# EAGLE schematic bubbles-mk-1.0 (EAGLE 6.5.0)
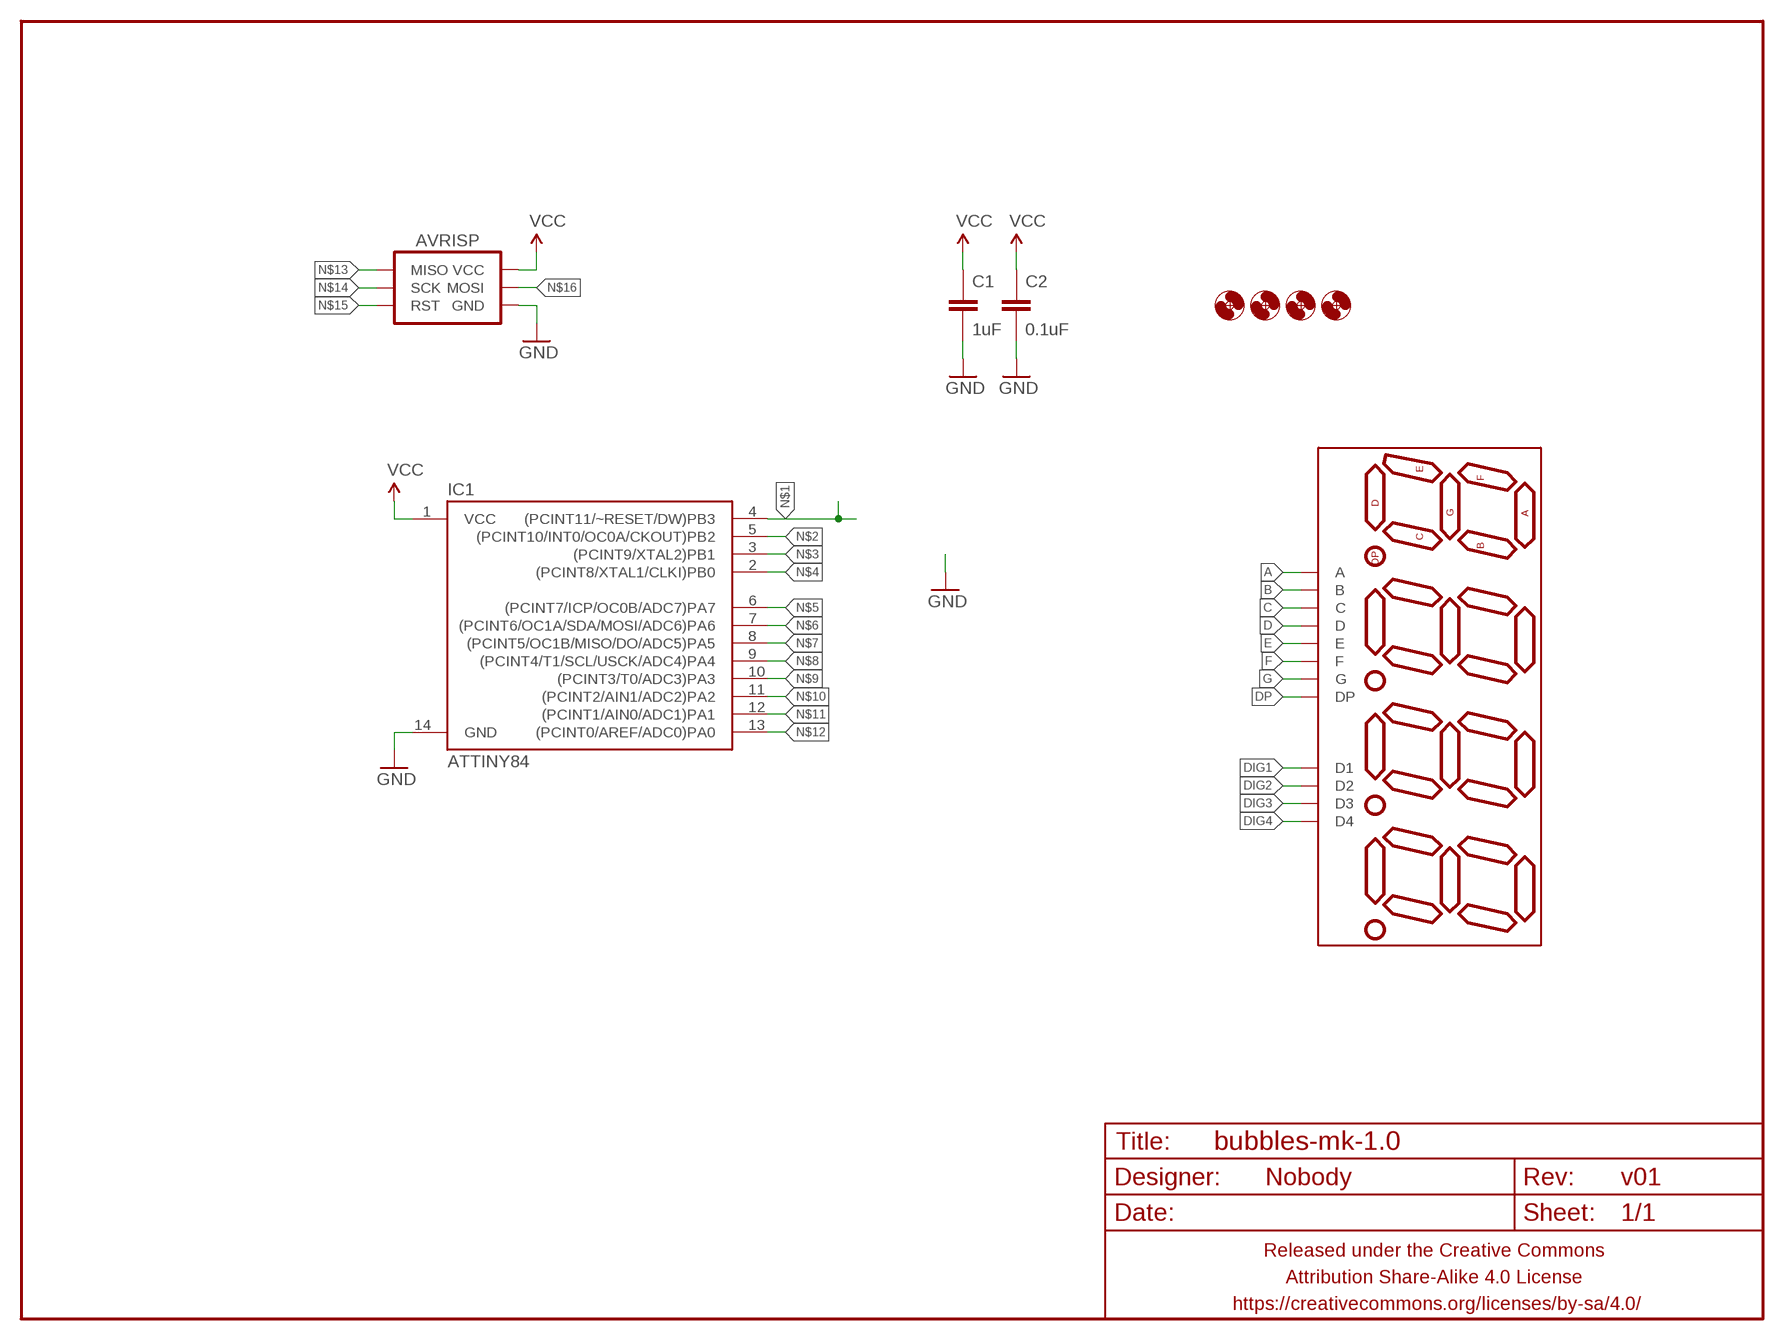
[diagram p0: schematic, sheet 1]

## Parts
AVRISP  AVR_SPI_PRG_6AVR-JST-PTH-RA-I2C  [AVR-JST-6-PTH-RA-I2C]
C1  1uF  CAPACITOR-CERAMIC025-024X044  [C025-024X044]
C2  0.1uF  CAPACITOR-CERAMIC025-024X044  [C025-024X044]
DISP1  BUBBLES!  7-SEGMENT-4DIGIT-COUNTER-HP-BUBBLE  [DIL12]
FRAME1  FRAME-LETTERNO_PACKAGE  [DUMMY]
H1  HOLE#2  [HOLE-#2]
H2  HOLE#2  [HOLE-#2]
H3  HOLE#2  [HOLE-#2]
H4  HOLE#2  [HOLE-#2]
IC1  ATTINY84  [SO14]

## Nets
A: DISP1.12(A)
B: DISP1.11(B)
C: DISP1.3(C)
D: DISP1.8(D)
DIG1: DISP1.1(D1)
DIG2: DISP1.10(D2)
DIG3: DISP1.4(D3)
DIG4: DISP1.6(D4)
DP: DISP1.5(DP)
E: DISP1.2(E)
F: DISP1.9(F)
G: DISP1.7(G)
GND: C1.2 C2.2 IC1.14(GND)
N$1: IC1.4((PCINT11/~RESET/DW)PB3)
N$2: IC1.5((PCINT10/INT0/OC0A/CKOUT)PB2)
N$3: IC1.3((PCINT9/XTAL2)PB1)
N$4: IC1.2((PCINT8/XTAL1/CLKI)PB0)
N$5: IC1.6((PCINT7/ICP/OC0B/ADC7)PA7)
N$6: IC1.7((PCINT6/OC1A/SDA/MOSI/ADC6)PA6)
N$7: IC1.8((PCINT5/OC1B/MISO/DO/ADC5)PA5)
N$8: IC1.9((PCINT4/T1/SCL/USCK/ADC4)PA4)
N$9: IC1.10((PCINT3/T0/ADC3)PA3)
N$10: IC1.11((PCINT2/AIN1/ADC2)PA2)
N$11: IC1.12((PCINT1/AIN0/ADC1)PA1)
N$12: IC1.13((PCINT0/AREF/ADC0)PA0)
N$13: AVRISP.MISO
N$14: AVRISP.SCK
N$15: AVRISP.RESET(RST)
N$16: AVRISP.MOSI/SDA(MOSI)
VCC: C1.1 C2.1 IC1.1(VCC)
Unconnected: AVRISP.GND AVRISP.VCC

## Library data of the parts
AVRISP = A_butts:AVR_SPI_PRG_6: AVR ISP 6 Pin This is the reduced ISP connector for AVR programming. Common on Arduino. This footprint will take up less PCB space and can be used with a 10-pin to 6-pin adapter such as SKU: BOB-08508 **Special note about "TEST_POINT" package. The stop mask is on the top side, so if you want your programming test points to be on the bottom of your board, make sure to place this package on the bottom side of the board. This also ensure that the orientation to program from the bottom side will be correct.
C1 C2 = A_butts:CAPACITOR-CERAMIC: CAPACITOR, European symbol
DISP1 = A_butts:7-SEGMENT-4DIGIT-COUNTER; STOREFRONT: COM-12710
FRAME1 = A_butts:FRAME-LETTER: Schematic Frame Standard 8.5x11 US Letter frame; DESIGNER: Nobody; VERSION: v01
H1-H4 = A_butts:HOLE: MOUNTING HOLE with drill center marker
IC1 = A_butts:ATTINY84: Atmel 14-pin 2/4/8kB flash uC